# Altium schematic sheet REUN.ONK.20.000_Work_Tool_E4.SchDoc: Рабочий инструмент
size 594 x 420 mm; Date: 22.12.22; ApprovedBy: Шавликов; CheckedBy: Шавликов; DrawnBy: Подлесный; DocumentNumber: РЕУН.ОНК.20.000 Э4 2D; SheetTotal: 1; Format: A2; DocumentType: Схема электрическая соединений; ImagePath: РЕУН.ОНК.20.000 2D
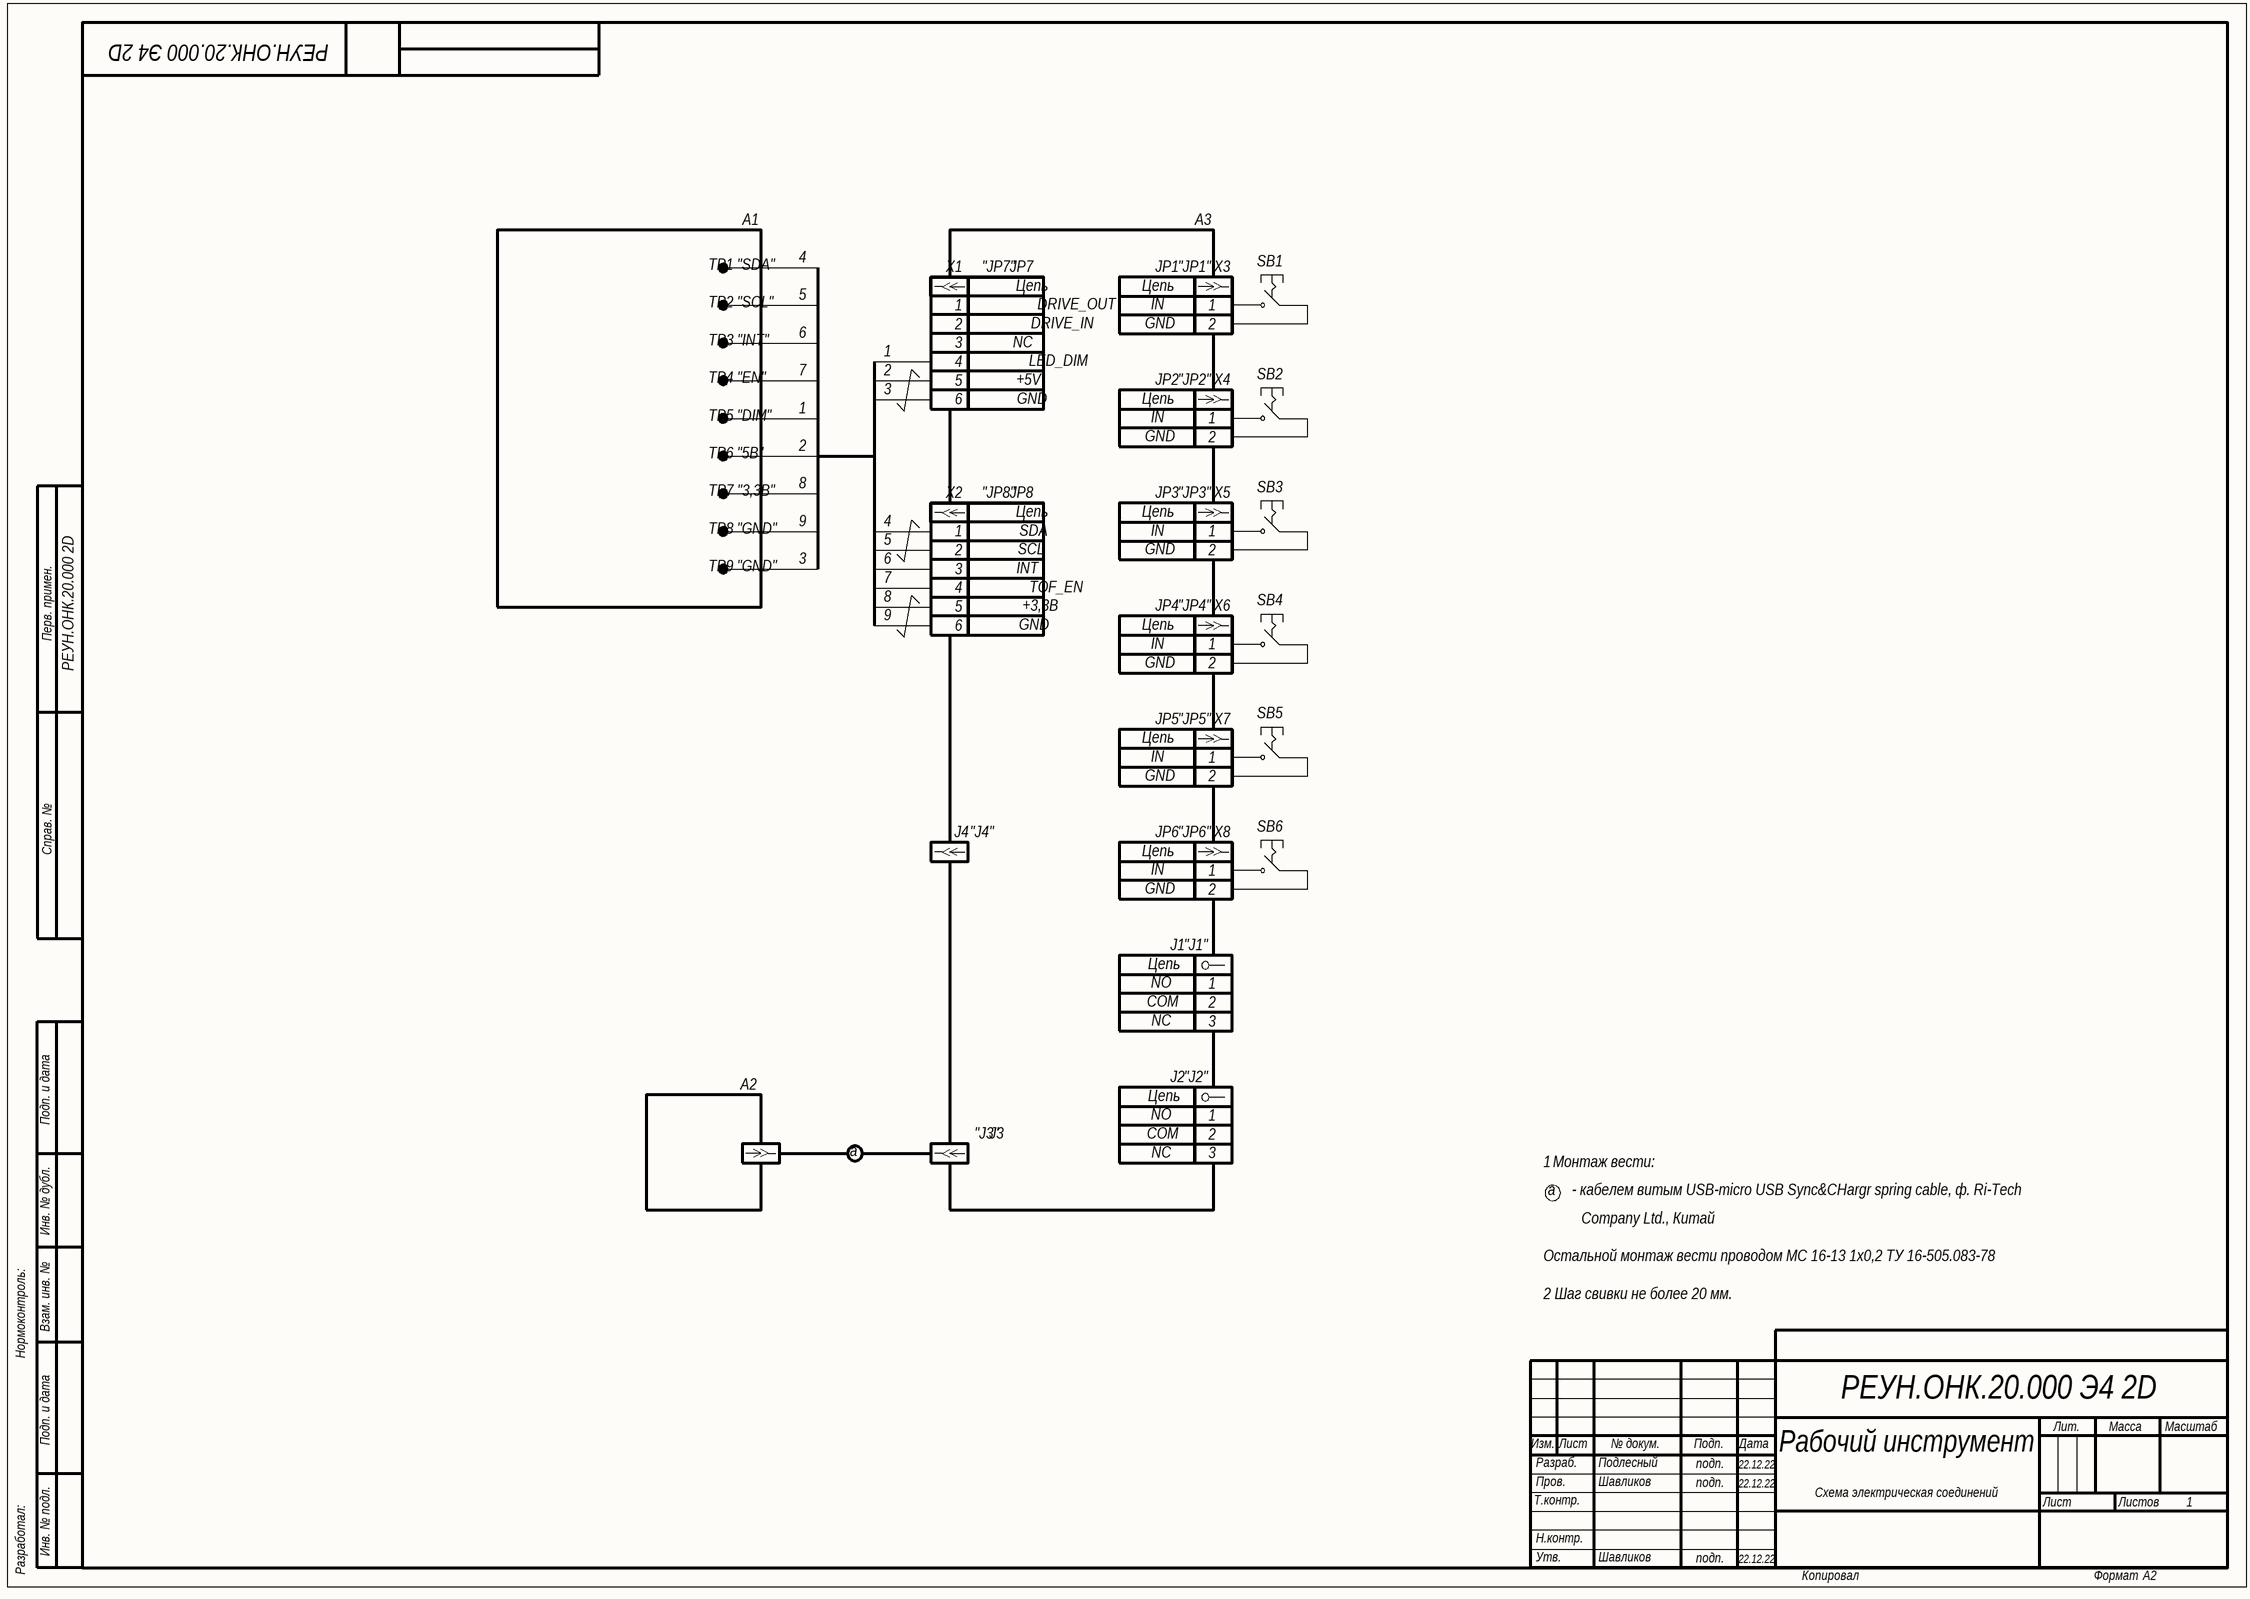
[diagram p0: REUN.ONK.20.000_Work_Tool_E4.SchDoc]

## Notes on the sheet
- A1
- A3
- TP2 "SCL"
- TP1 "SDA"
- X1
- 1
- "JP7"
- JP7
- Цепь
- DRIVE_OUT
- IN
- JP1
- "JP1"
- X3
- SB1
- TP3 "INT"
- 2
- 3
- NC
- DRIVE_IN
- GND
- TP4 "EN"
- 4
- 5
- 6
- +5V
- LED_DIM
- JP2
- "JP2"
- X4
- SB2
- TP5 "DIM"
- TP6 "5B"
- TP7 "3,3B"
- X2
- "JP8"
- JP8
- JP3
- "JP3"
- X5
- SB3
- TP8 "GND"
- SDA
- Перв. примен.
- TP9 "GND"
- INT
- SCL
- TOF_EN
- +3,3B
- JP4
- "JP4"
- X6
- SB4
- JP5
- "JP5"
- X7
- SB5
- Справ. №
- J4
- "J4"
- JP6
- "JP6"
- X8
- SB6
- J1
- "J1"
- COM
- NO
- Подп. и дата
- A2
- J2
- "J2"
- а
- "J3"
- J3
- Монтаж вести:
- Инв. № дубл.
- a
- - кабелем витым USB-micro USB Sync&CHargr spring cable, ф. Ri-Tech
- Остальной монтаж вести проводом МС 16-13 1х0,2 ТУ 16-505.083-78
- Company Ltd., Китай
- Нормоконтроль:
- Взам. инв. №
- 2 Шаг свивки не более 20 мм.
- Изм.
- Лист
- № докум.
- Подп.
- Дата
- Лит.
- Масса
- Масштаб
- Т.контр.
- Пров.
- Разраб.
- подп.
- Листов
- Разработал:
- Инв. № подл.
- Н.контр.
- Утв.
- Копировал
- Формат
- Labels drawn without touching a wire or pin: 1, 2, 3, 4, 5, 6, 7, 8, 9